# Altium project STM 32 F4 Robusta V1.PrjPcb
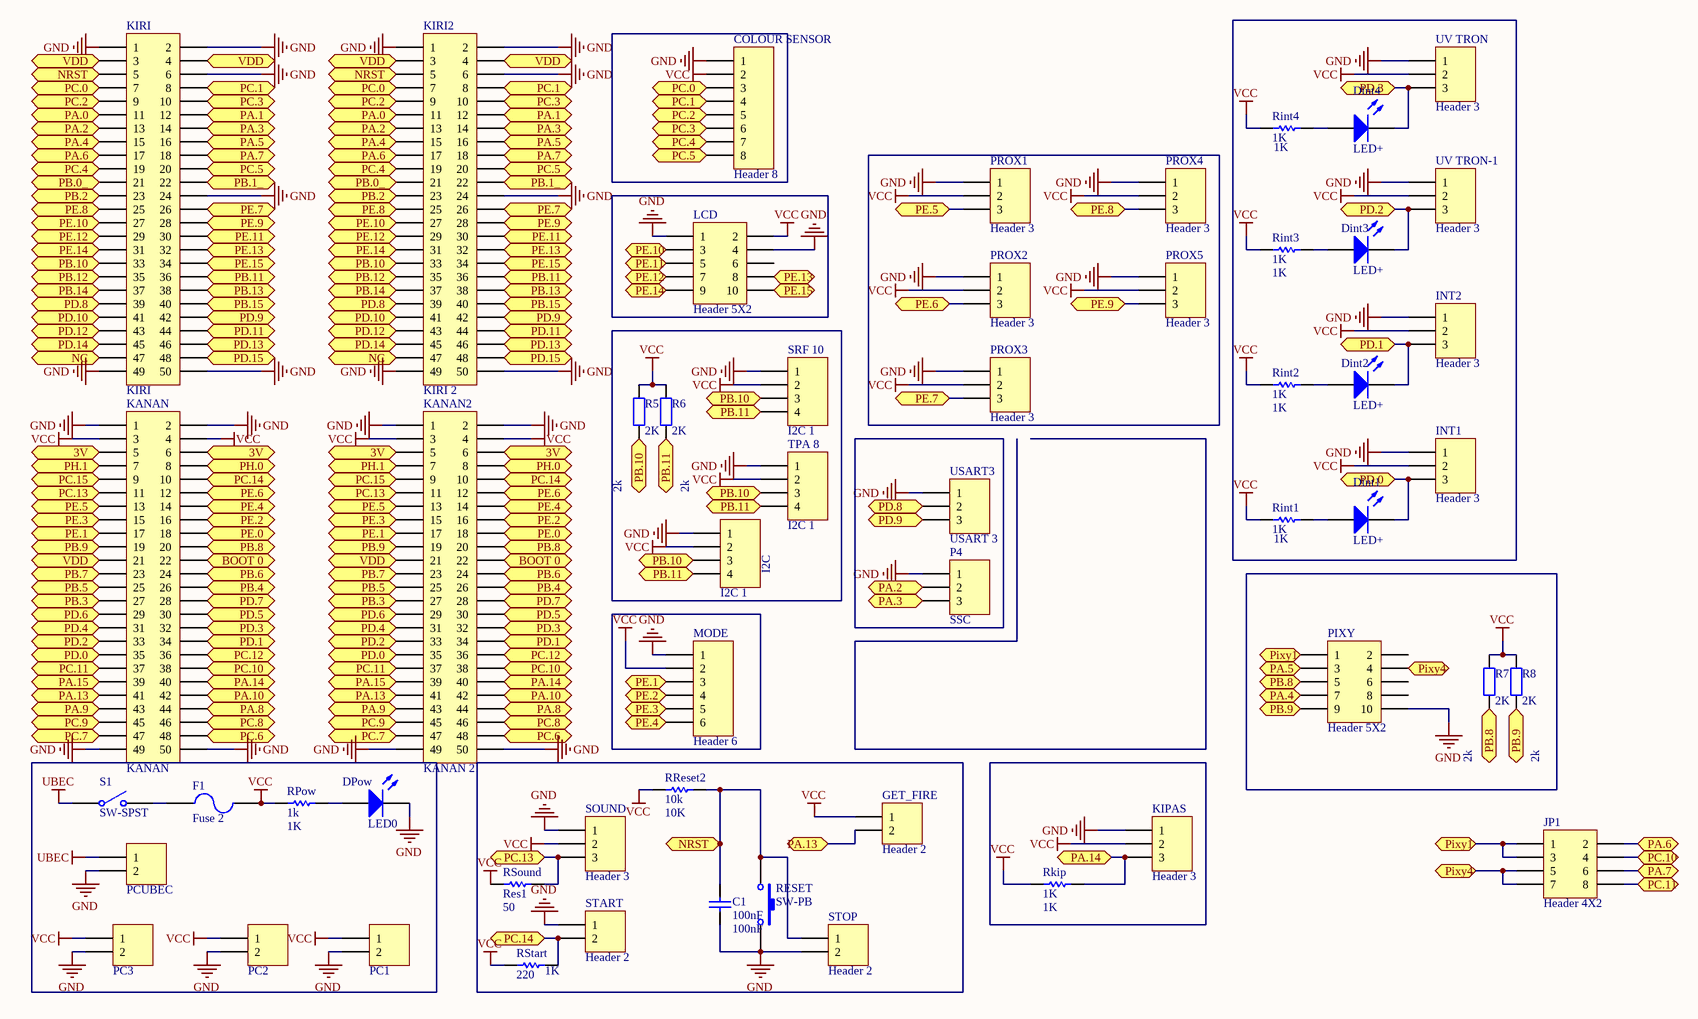
[diagram p0: STM 32 F4 Robusta V1.SchDoc]
1 sheet, 54 parts. Net scope: flat (ports and power ports of the same name join across sheets).
Board file: STM 32 F4 Robusta V1.PcbDoc

## Sheet STM 32 F4 Robusta V1.SchDoc
size A3

### Parts
C1  100nF  [C1206]
COLOUR_SENSOR  Header 8  [HDR1X8]
Dint1  LED+  [1206]
Dint2  LED+  [1206]
Dint3  LED+  [1206]
Dint4  LED+  [1206]
DPow  LED0  [1206]
F1  Fuse 2  [PCBComponent_1]
GET_FIRE  Header 2  [HDR1X2]
I2C  I2C 1  [HDR1X4]
INT1  Header 3  [HDR1X3]
INT2  Header 3  [HDR1X3]
JP1  Header 4X2  [HDR2X4]
KANAN  KANAN  [HDR2X25]
KANAN2  KANAN 2  [HDR2X25]
KIPAS  Header 3  [HDR1X3]
KIRI  KIRI  [HDR2X25]
KIRI2  KIRI 2  [HDR2X25]
LCD  Header 5X2  [HDR2X5]
MODE  Header 6  [HDR1X6]
P4  SSC  [HDR1X3]
PC1  Power Connector  [My_ Power_Connector]  (value not drawn)
PC2  Power Connector  [My_ Power_Connector]  (value not drawn)
PC3  Power Connector  [My_ Power_Connector]  (value not drawn)
PCUBEC  Power Connector  [My_ Power_Connector]  (value not drawn)
PIXY  Header 5X2  [HDR2X5]
PROX1  Header 3  [HDR1X3]
PROX2  Header 3  [HDR1X3]
PROX3  Header 3  [HDR1X3]
PROX4  Header 3  [HDR1X3]
PROX5  Header 3  [HDR1X3]
R5  2k  [1206]
R6  2k  [1206]
R7  2k  [1206]
R8  2k  [1206]
RESET  SW-PB  [SPST-2]
Rint1  1K  [1206]
Rint2  1K  [1206]
Rint3  1K  [1206]
Rint4  1K  [1206]
Rkip  1K  [1206]
RPow  1k  [1206]
RReset2  10k  [1206]
RSound  Res1  value 50  [1206]
RStart  220  value 1K  [1206]
S1  SW-SPST  [SPST-2]
SOUND  Header 3  [HDR1X3]
SRF_10  I2C 1  [HDR1X4]
START  Header 2  [HDR1X2]
STOP  Header 2  [HDR1X2]
TPA_8  I2C 1  [HDR1X4]
USART3  USART 3  [HDR1X3]
UV_TRON  Header 3  [HDR1X3]
UV_TRON-1  Header 3  [HDR1X3]

### Ports
3V, BOOT 0, NC, NRST, PA.0, PA.1, PA.2, PA.3, PA.4, PA.5, PA.6, PA.7, PA.8, PA.9, PA.10, PA.13, PA.14, PA.15, PB.0_, PB.1_, PB.2, PB.3, PB.4, PB.5, PB.6, PB.7, PB.8, PB.9, PB.10, PB.11, PB.12, PB.13, PB.14, PB.15, PC.0, PC.1, PC.2, PC.3, PC.4, PC.5, PC.6, PC.7, PC.8, PC.9, PC.10, PC.11, PC.12, PC.13, PC.14, PC.15, PD.0, PD.1, PD.2, PD.3, PD.4, PD.5, PD.6, PD.7, PD.8, PD.9, PD.10, PD.11, PD.12, PD.13, PD.14, PD.15, PE.0, PE.1, PE.2, PE.3, PE.4, PE.5, PE.6, PE.7, PE.8, PE.9, PE.10, PE.11, PE.12, PE.13, PE.14, PE.15, PH.0, PH.1, Pixy1, Pixy4, VDD

### Nets
GND: C1.1 COLOUR_SENSOR.1 DPow.2(K) I2C.1 INT1.1 INT2.1 KANAN.1 KANAN.2 KANAN.49 KANAN.50 KANAN2.1 KANAN2.2 KANAN2.49 KANAN2.50 KIPAS.1 KIRI.1 KIRI.2 KIRI.6 KIRI.24 KIRI.49 KIRI.50 KIRI2.1 KIRI2.2 KIRI2.6 KIRI2.24 KIRI2.49 KIRI2.50 LCD.1 LCD.4 MODE.1 P4.1 PC1.2 PC2.2 PC3.2 PCUBEC.2 PIXY.10 PROX1.1 PROX2.1 PROX3.1 PROX4.1 PROX5.1 RESET.1 SOUND.1 SRF_10.1 START.1 STOP.2 TPA_8.1 USART3.1 UV_TRON.1 UV_TRON-1.1
UBEC: PCUBEC.1 S1.1(COMMON)
VCC: COLOUR_SENSOR.2 F1.2 GET_FIRE.1 I2C.2 INT1.2 INT2.2 KANAN.3 KANAN.4 KANAN2.3 KANAN2.4 KIPAS.2 LCD.2 MODE.2 PC1.1 PC2.1 PC3.1 PROX1.2 PROX2.2 PROX3.2 PROX4.2 PROX5.2 R5.2 R6.2 R7.2 R8.2 Rint1.1 Rint2.1 Rint3.1 Rint4.1 Rkip.1 RPow.1 RReset2.2 RSound.1 RStart.1 SOUND.2 SRF_10.2 TPA_8.2 UV_TRON.2 UV_TRON-1.2
NetC1_2: C1.2 KIRI.5 KIRI2.5 RESET.2 RReset2.1 STOP.1 ; port NRST
NetCOLOUR_SENSOR_3: COLOUR_SENSOR.3 KIRI.7 KIRI2.7 ; port PC.0
NetCOLOUR_SENSOR_4: COLOUR_SENSOR.4 KIRI.8 KIRI2.8 ; port PC.1
NetCOLOUR_SENSOR_5: COLOUR_SENSOR.5 KIRI.9 KIRI2.9 ; port PC.2
NetCOLOUR_SENSOR_6: COLOUR_SENSOR.6 KIRI.10 KIRI2.10 ; port PC.3
NetCOLOUR_SENSOR_7: COLOUR_SENSOR.7 KIRI.19 KIRI2.19 ; port PC.4
NetCOLOUR_SENSOR_8: COLOUR_SENSOR.8 KIRI.20 KIRI2.20 ; port PC.5
NetDint1_1: Dint1.1(A) Rint1.2
NetDint1_2: Dint1.2(K) INT1.3 KANAN.35 KANAN2.35 ; port PD.0
NetDint2_1: Dint2.1(A) Rint2.2
NetDint2_2: Dint2.2(K) INT2.3 KANAN.34 KANAN2.34 ; port PD.1
NetDint3_1: Dint3.1(A) Rint3.2
NetDint3_2: Dint3.2(K) KANAN.33 KANAN2.33 UV_TRON-1.3 ; port PD.2
NetDint4_1: Dint4.1(A) Rint4.2
NetDint4_2: Dint4.2(K) KANAN.32 KANAN2.32 UV_TRON.3 ; port PD.3
NetDPow_1: DPow.1(A) RPow.2
NetF1_1: F1.1 S1.2(NO)
NetGET_FIRE_2: GET_FIRE.2 KANAN.41 KANAN2.41 ; port PA.13
NetI2C_3: I2C.3 KIRI.33 KIRI2.33 R5.1 SRF_10.3 TPA_8.3 ; port PB.10
NetI2C_4: I2C.4 KIRI.36 KIRI2.36 R6.1 SRF_10.4 TPA_8.4 ; port PB.11
NetJP1_1: JP1.1 JP1.3 PIXY.1 ; port Pixy1
NetJP1_2: JP1.2 KIRI.17 KIRI2.17 ; port PA.6
NetJP1_4: JP1.4 KANAN.38 KANAN2.38 ; port PC.10
NetJP1_5: JP1.5 JP1.7 PIXY.4 ; port Pixy4
NetJP1_6: JP1.6 KIRI.18 KIRI2.18 ; port PA.7
NetJP1_8: JP1.8 KANAN.37 KANAN2.37 ; port PC.11
NetKANAN_5: KANAN.5 KANAN.6 KANAN2.5 KANAN2.6 ; port 3V
NetKANAN_7: KANAN.7 KANAN2.7 ; port PH.1
NetKANAN_8: KANAN.8 KANAN2.8 ; port PH.0
NetKANAN_9: KANAN.9 KANAN2.9 ; port PC.15
NetKANAN_10: KANAN.10 KANAN2.10 RStart.2 START.2 ; port PC.14
NetKANAN_11: KANAN.11 KANAN2.11 RSound.2 SOUND.3 ; port PC.13
NetKANAN_12: KANAN.12 KANAN2.12 PROX2.3 ; port PE.6
NetKANAN_13: KANAN.13 KANAN2.13 PROX1.3 ; port PE.5
NetKANAN_14: KANAN.14 KANAN2.14 MODE.6 ; port PE.4
NetKANAN_15: KANAN.15 KANAN2.15 MODE.5 ; port PE.3
NetKANAN_16: KANAN.16 KANAN2.16 MODE.4 ; port PE.2
NetKANAN_17: KANAN.17 KANAN2.17 MODE.3 ; port PE.1
NetKANAN_18: KANAN.18 KANAN2.18 ; port PE.0
NetKANAN_19: KANAN.19 KANAN2.19 PIXY.9 R8.1 ; port PB.9
NetKANAN_20: KANAN.20 KANAN2.20 PIXY.5 R7.1 ; port PB.8
NetKANAN_21: KANAN.21 KANAN2.21 KIRI.3 KIRI.4 KIRI2.3 KIRI2.4 ; port VDD
NetKANAN_22: KANAN.22 KANAN2.22 ; port BOOT 0
NetKANAN_23: KANAN.23 KANAN2.23 ; port PB.7
NetKANAN_24: KANAN.24 KANAN2.24 ; port PB.6
NetKANAN_25: KANAN.25 KANAN2.25 ; port PB.5
NetKANAN_26: KANAN.26 KANAN2.26 ; port PB.4
NetKANAN_27: KANAN.27 KANAN2.27 ; port PB.3
NetKANAN_28: KANAN.28 KANAN2.28 ; port PD.7
NetKANAN_29: KANAN.29 KANAN2.29 ; port PD.6
NetKANAN_30: KANAN.30 KANAN2.30 ; port PD.5
NetKANAN_31: KANAN.31 KANAN2.31 ; port PD.4
NetKANAN_36: KANAN.36 KANAN2.36 ; port PC.12
NetKANAN_39: KANAN.39 KANAN2.39 ; port PA.15
NetKANAN_40: KANAN.40 KANAN2.40 KIPAS.3 Rkip.2 ; port PA.14
NetKANAN_42: KANAN.42 KANAN2.42 ; port PA.10
NetKANAN_43: KANAN.43 KANAN2.43 ; port PA.9
NetKANAN_44: KANAN.44 KANAN2.44 ; port PA.8
NetKANAN_45: KANAN.45 KANAN2.45 ; port PC.9
NetKANAN_46: KANAN.46 KANAN2.46 ; port PC.8
NetKANAN_47: KANAN.47 KANAN2.47 ; port PC.7
NetKANAN_48: KANAN.48 KANAN2.48 ; port PC.6
NetKIRI_11: KIRI.11 KIRI2.11 ; port PA.0
NetKIRI_12: KIRI.12 KIRI2.12 ; port PA.1
NetKIRI_13: KIRI.13 KIRI2.13 P4.2 ; port PA.2
NetKIRI_14: KIRI.14 KIRI2.14 P4.3 ; port PA.3
NetKIRI_15: KIRI.15 KIRI2.15 PIXY.7 ; port PA.4
NetKIRI_16: KIRI.16 KIRI2.16 PIXY.3 ; port PA.5
NetKIRI_21: KIRI.21 KIRI2.21 ; port PB.0_
NetKIRI_22: KIRI.22 KIRI2.22 ; port PB.1_
NetKIRI_23: KIRI.23 KIRI2.23 ; port PB.2
NetKIRI_25: KIRI.25 KIRI2.25 PROX4.3 ; port PE.8
NetKIRI_26: KIRI.26 KIRI2.26 PROX3.3 ; port PE.7
NetKIRI_27: KIRI.27 KIRI2.27 LCD.3 ; port PE.10
NetKIRI_28: KIRI.28 KIRI2.28 PROX5.3 ; port PE.9
NetKIRI_29: KIRI.29 KIRI2.29 LCD.7 ; port PE.12
NetKIRI_30: KIRI.30 KIRI2.30 LCD.5 ; port PE.11
NetKIRI_31: KIRI.31 KIRI2.31 LCD.9 ; port PE.14
NetKIRI_32: KIRI.32 KIRI2.32 LCD.8 ; port PE.13
NetKIRI_34: KIRI.34 KIRI2.34 LCD.10 ; port PE.15
NetKIRI_35: KIRI.35 KIRI2.35 ; port PB.12
NetKIRI_37: KIRI.37 KIRI2.37 ; port PB.14
NetKIRI_38: KIRI.38 KIRI2.38 ; port PB.13
NetKIRI_39: KIRI.39 KIRI2.39 USART3.2 ; port PD.8
NetKIRI_40: KIRI.40 KIRI2.40 ; port PB.15
NetKIRI_41: KIRI.41 KIRI2.41 ; port PD.10
NetKIRI_42: KIRI.42 KIRI2.42 USART3.3 ; port PD.9
NetKIRI_43: KIRI.43 KIRI2.43 ; port PD.12
NetKIRI_44: KIRI.44 KIRI2.44 ; port PD.11
NetKIRI_45: KIRI.45 KIRI2.45 ; port PD.14
NetKIRI_46: KIRI.46 KIRI2.46 ; port PD.13
NetKIRI_47: KIRI.47 KIRI2.47 ; port NC
NetKIRI_48: KIRI.48 KIRI2.48 ; port PD.15

Not connected (* = marked no-connect by the designer): LCD 6; PIXY 2 6 8

### Library data of the parts
C1 = Cap: Capacitor; Published: 8-Jun-2000; LatestRevisionDate: 17-Jul-2002; LatestRevisionNote: Re-released for DXP Platform.; PackageReference: RAD-0.3; Publisher: Altium Limited; PackageDescription: Radial Cap, Thru-Hole; 2 Leads; 0.3 in Pin Spacing; Value: 100nF
COLOUR_SENSOR = Header 8: Header, 8-Pin; LatestRevisionDate: 17-Jul-2002; LatestRevisionNote: Re-released for DXP Platform.; Publisher: Altium Limited
Dint1-Dint4 DPow = LED0: Typical INFRARED GaAs LED; Published: 8-Jun-2000; LatestRevisionDate: 08-Jul-2005; LatestRevisionNote: Mech Layer 1 removed.; PackageReference: LED-0; Publisher: Altium Limited
F1 = Fuse 2: Fuse; Published: 8-Jun-2000; LatestRevisionDate: 17-Jul-2002; LatestRevisionNote: Re-released for DXP Platform.; PackageReference: PIN-W2/E2.8; Publisher: Altium Limited
GET_FIRE START STOP = Header 2: Header, 2-Pin; LatestRevisionDate: 17-Jul-2002; LatestRevisionNote: Re-released for DXP Platform.; Publisher: Altium Limited
I2C SRF_10 TPA_8 = Header 4: Header, 4-Pin; LatestRevisionDate: 17-Jul-2002; LatestRevisionNote: Re-released for DXP Platform.; Publisher: Altium Limited
INT1 INT2 KIPAS P4 PROX1-PROX5 SOUND USART3 UV_TRON UV_TRON-1 = Header 3: Header, 3-Pin; LatestRevisionDate: 17-Jul-2002; LatestRevisionNote: Re-released for DXP Platform.; Publisher: Altium Limited
JP1 = Header 4X2: Header, 4-Pin, Dual row; LatestRevisionDate: 17-Jul-2002; LatestRevisionNote: Re-released for DXP Platform.; Publisher: Altium Limited
KANAN KANAN2 KIRI KIRI2 = Header 25X2: Header, 25-Pin, Dual row; LatestRevisionDate: 17-Jul-2002; LatestRevisionNote: Re-released for DXP Platform.; Publisher: Altium Limited
LCD PIXY = Header 5X2: Header, 5-Pin, Dual row; LatestRevisionDate: 17-Jul-2002; LatestRevisionNote: Re-released for DXP Platform.; Publisher: Altium Limited
MODE = Header 6: Header, 6-Pin; LatestRevisionDate: 17-Jul-2002; LatestRevisionNote: Re-released for DXP Platform.; Publisher: Altium Limited
PC1-PC3 PCUBEC = Power Connector: white Power Connector
R5-R8 = Res2: Resistor; Published: 8-Jun-2000; LatestRevisionDate: 17-Jul-2002; LatestRevisionNote: Re-released for DXP Platform.; PackageReference: AXIAL-0.4; Publisher: Altium Limited; Value: 2K
RESET = SW-PB: Switch; Published: 24-Mar-1999; LatestRevisionDate: 17-Jul-2002; LatestRevisionNote: Re-released for DXP Platform.; PackageReference: SPST-2; Publisher: Altium Limited
Rint1-Rint4 Rkip RPow RReset2 RSound RStart = Res1: Resistor; Published: 8-Jun-2000; LatestRevisionDate: 17-Jul-2002; LatestRevisionNote: Re-released for DXP Platform.; PackageReference: AXIAL-0.3; Publisher: Altium Limited
  Rint1-Rint4 Rkip RPow: Value: 1K
  RReset2: Value: 10K
S1 = SW-SPST: Single-Pole, Single-Throw Switch; Published: 24-Mar-1999; LatestRevisionDate: 17-Jul-2002; LatestRevisionNote: Re-released for DXP Platform.; PackageReference: SPST-2; Publisher: Altium Limited